# EAGLE design arduino_uno (EAGLE 8.3.1)
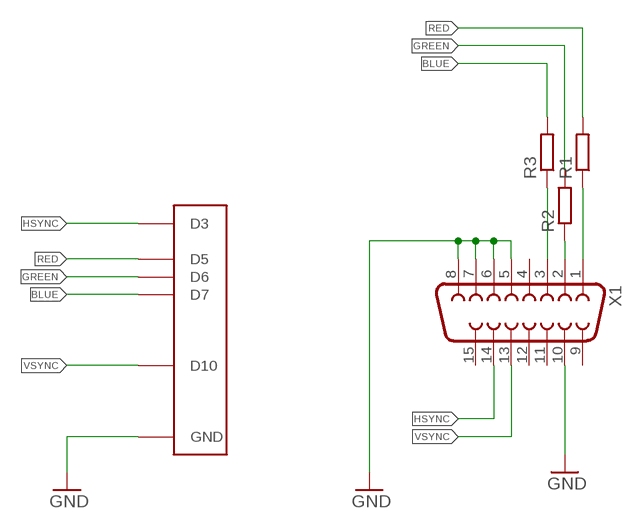
[diagram p0: schematic, sheet 1]

## Parts
R1  R-EU_0207/10  [0207/10]
R2  R-EU_0207/10  [0207/10]
R3  R-EU_0207/10  [0207/10]
U$1  ARDUINOUNO  [ARDUINO]
X1  F15HDV  [HDF15V]

## Nets
BLUE: R3.2 U$1.D7
GND: U$1.GND X1.5 X1.6 X1.7 X1.8 X1.10
GREEN: R2.2 U$1.D6
HSYNC: U$1.D3 X1.14
N$4: R1.1 X1.1
N$5: R2.1 X1.2
N$6: R3.1 X1.3
RED: R1.2 U$1.D5
VSYNC: U$1.D10 X1.13
Unconnected: X1.4 X1.9 X1.11 X1.12 X1.15

## Library data of the parts
R1-R3 = resistor:R-EU_: RESISTOR, European symbol
U$1 = ube:ARDUINO: Arduino Diecimila/Duemilanove Make a shield with ease, this package has all the named pins as well as the two mounting drill holes and an outline of the USB and DC power connector. The outline is on the DIMENSION layer, so if your board house uses it they will cut the outline to match. http://www.ladyada.net/library/pcb/eaglelibrary.html
X1 = adafruit:F15: SUB-D HDH is also known as a 'right angle VGA' connector

## Net classes
0 default: width 0.406 mm

## Board
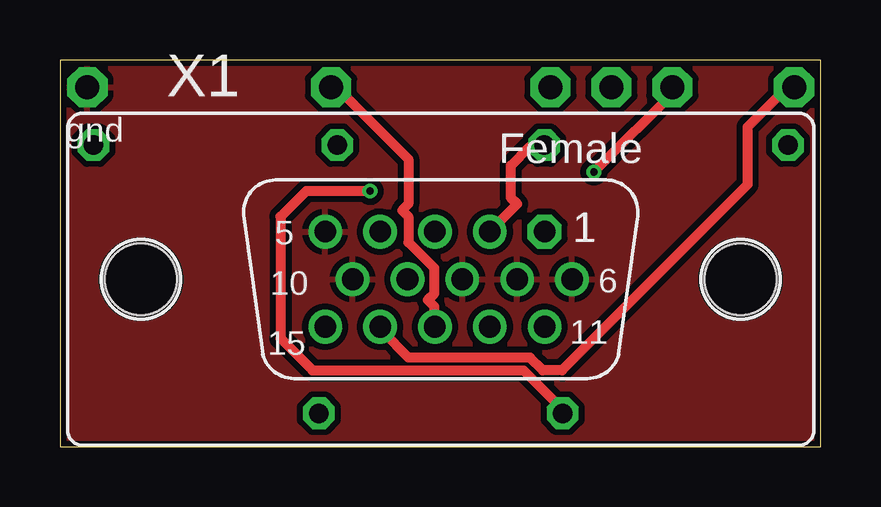
[diagram p1: board, top side]
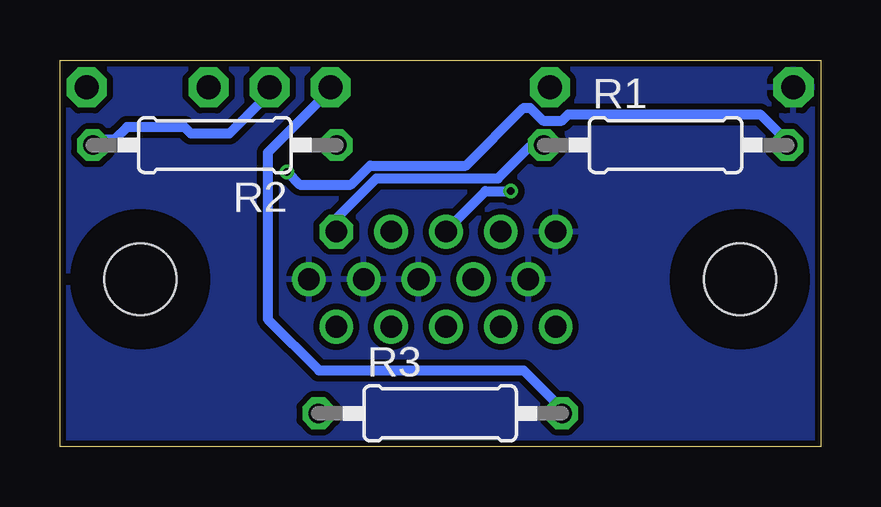
[diagram p2: board, bottom side, seen from below]

Size 31.72 x 16.12 mm. Coordinates in mm from the lower left corner, seen from the top.
Outline: 0,0 31.72,0 31.72,16.12 0,16.12 0,0
Copper layers (1*16): Top 0.035mm / dielectric 1.5mm / Bottom 0.035mm
Design rules "dirt_cheap_dirty_boards.v1": minimum track width 5mil, minimum drill 12mil, track to track 5mil, track to pad 5mil, pad to pad 5mil, via to via 5mil, smd to smd 0mil, copper to edge 10mil, drill to drill 10mil, minimum pad ring 10mil, minimum via ring 6mil, stop-mask expansion 2mil, vias tented up to drill 25mil, thermal gap 10mil

### Footprints (pad centres in the part's own frame; a part is rotated, then mirrored left to right if it is on the bottom)
0207/10 = drill 0.813 octagon: 1 -5.08,0; 2 5.08,0
ARDUINO = drill 1 pad 1.676 octagon: D3 55.88,50.8; D5 50.8,50.8; D6 48.26,50.8; D7 45.72,50.8; D10 36.576,50.8; GND 26.416,50.8
HDF15V = drill 0.9 octagon: 1 4.329,1.98 | drill 0.9: 2 2.043,1.98; 3 -0.243,1.98; 4 -2.529,1.98; 5 -4.815,1.98; 6 5.472,0; 7 3.186,0; 8 0.9,0; 9 -1.386,0; 10 -3.672,0; 11 4.329,-1.98; 12 2.043,-1.98; 13 -0.243,-1.98; 14 -2.529,-1.98; 15 -4.815,-1.98 | hole 3: -12.5,0; 12.5,0

### Placement (x,y rotation side)
R1  6.48,12.57 0 bottom
R2  25.27,12.57 180 bottom
R3  15.88,1.4 0 bottom
U$1  -25.27,-35.81 0 top
X1  15.88,6.98 0 top

### Tracks (layer width: path | path; a pad name or v marks a point on that pad's centre or on a via)
BLUE
  Bottom 0.406: R3.2 10.79,1.59 12.4,3.19 20.93,3.19 23.06,5.32 23.06,12.26 20.4,14.92 U$1.D7
GND
  pour Top (isolate 0.254): -1.14,18.54 33.15,18.54 33.15,-1.78 -1.14,-1.78
  pour Bottom (isolate 0.254): 0.13,17.27 33.15,17.27 33.15,-0.51 -1.14,-0.51 -1.14,17.27
GREEN
  Bottom 0.406: R2.2 30.26,12.79 29.46,12.79 28.93,13.32 26.53,13.32 26.26,13.06 24.66,13.06 22.8,14.92 U$1.D6
HSYNC
  Top 0.406: X1.14 13.46,4.79 14.53,3.72 19.6,3.72 20.13,3.19 20.93,3.19 28.66,10.92 28.66,13.32 30.53,15.19 U$1.D3
N$4
  Bottom 0.406: R1.1 11.6,12.52 12.13,12.52 13.46,11.19 18.53,11.19 20.13,9.59 20.13,9.05 X1.1
N$5
  Top 0.406: R2.1 20.13,12.52 19.6,12.52 18.8,11.72 18.8,10.39 19.06,10.12 18,9.05 X1.2
N$6  (via drill 0.3)
  Top 0.406: v12.93,10.66 10.26,10.66 9.2,9.59 9.2,4.52 10.53,3.19 19.33,3.19 20.93,1.59 R3.1
  Bottom 0.406: v12.93,10.66 14,10.66 15.6,9.05 X1.3
RED  (via drill 0.3)
  Top 0.406: v22.26,11.45 25.73,14.92 U$1.D5
  Bottom 0.406: v22.26,11.45 21.73,10.92 19.6,10.92 18.8,11.72 14.79,11.72 12.4,14.12 12.13,14.12 11.6,13.59 10.79,13.59 10.53,13.86 2.53,13.86 1.46,12.79 R1.2
VSYNC
  Top 0.406: X1.13 15.6,5.05 15.6,5.86 15.33,6.12 15.6,6.39 15.6,7.45 14.53,8.52 14.53,9.59 14.26,9.86 14.53,10.12 14.53,11.99 11.33,15.19 U$1.D10